# Altium schematic sheet 5Vto3V3Buck.SchDoc: 3V3 BUCK
size 431 x 279 mm; ApprovedBy: Wuji Zhang; CheckedBy: Wuji Zhang; Author: Wuji Zhang; CompanyName: Upenn; DrawnBy: Wuji Zhang; Engineer: Wuji Zhang; Organization: Upenn; Address1: ADDRESS 1; Address2: ADDRESS 2; Address3: ADDRESS 3; Address4: ADDRESS 4; Revision: -; SheetNumber: 2; SheetTotal: 9; ENG_APP_DATE: --/--/--; DSN_APP_DATE: --/--/--; CHK_APP_DATE: --/--/--
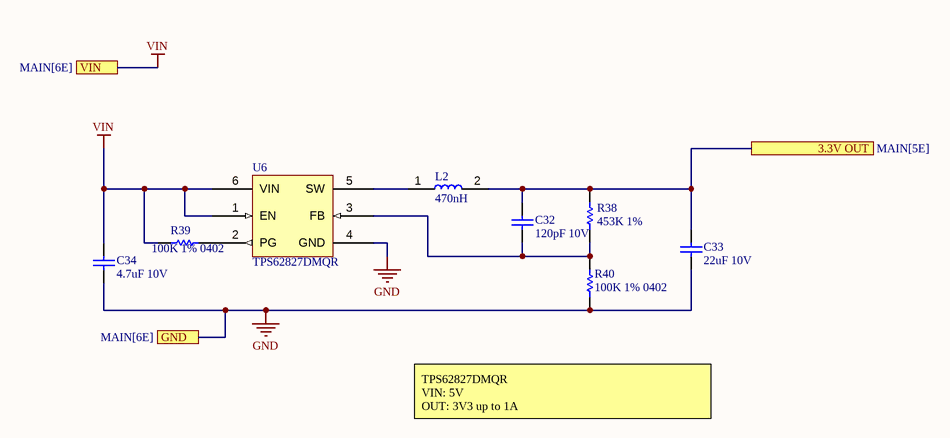
[diagram p0: 5Vto3V3Buck.SchDoc]

## Parts
C32  120pF 10V  [CAPC0603(1608)100_N]
C33  22uF 10V  [CAPC1608X100X20ML10]
C34  4.7uF 10V  [CAPC0603(1608)55_N]
L2  470nH  [MLP2012SR47MT0S1]
R38  453K 1%  [RESC0402(1005)_L]
R39  100K 1% 0402  [RESC0402(1005)_M]
R40  100K 1% 0402  [RESC0402(1005)_M]
U6  TPS62827DMQR  [Texas_Instruments_DMQ0006A_MFG]

## Ports
3.3V OUT (see MAIN[5E]), GND (see MAIN[6E]), VIN (see MAIN[6E])

## Nets
GND: C33.1 C34.1 R40.1 U6.4(GND) ; port GND
VIN: C34.2 R39.1 U6.1(EN) U6.6(VIN) ; port VIN
3.3V OUT: C32.2 C33.2 L2.2 R38.1 ; port 3.3V OUT
NetC32_1: C32.1 R38.2 R40.2 U6.3(FB)
NetL2_1: L2.1 U6.5(SW)
NetR39_2: R39.2 U6.2(PG)

## Notes on the sheet
- TPS62827DMQR
  VIN: 5V
  OUT: 3V3 up to 1A
- DWG. NO.
- REV.
- SHT.
- THIS DOCUMENT AND THE DATA DISCLOSED HEREIN OR HEREWITH IS THE PROPERTY OF ALTIUM LIMITED AND MAY BE FREELY DISTRIBUTED IN WHOLE. NO RIGHTS ARE RESERVED OR EXPRESS OR IMPLIED WARANTEE GIVEN.
- REVISION
- DESCRIPTION
- DATE
- APPROVED
- ENG:
- APPROVALS
- PROJECT
- DSN:
- CHK:
- REFERENCE DOCUMENTS
- PROJECT REVISION:
- TITLE
- DOCUMENT REVISION:
- DESIGN ITEM:
- BOM:
- FAB DWG:
- PCB DWG:
- ASSY DWG:
- SCALE:
- SIZE
- B
- CAGE CODE
- FILE NAME
- DWG NO.
- SHEET
- OF
- REV

## Library data of the parts
C32 = CMP-1035-01305-1: CAP 120pF 10V ±10% 0603 (1608 Metric) Thickness 1mm SMD; Case-EIA: 0603; Case-Metric: 1608; Tolerance: Â±10%; Technology: SMT; Rated Voltage: 10 V; Value: 120pF; Max Thickness: 1 mm
C33 = CMP-2000-05441-1: Chip Capacitor, 22 uF, +/- 20%, 10 V, -55 to 85 degC, 0603 (1608 Metric), RoHS, Tape and Reel; Manufacturer: TDK; PCN Part Number: MLCCPartNumberChange30/Nov/2012; Product Training Modules: CSeriesGeneralApplicationsSEAT,CCV,andTVCLDesignToolsGuidetoReplacinganElectrolyticCapacitorwithanMLCC; Other Names: 445-9077-1; Design Resources: 20WNon-IsolatedBuckLEDDriverUsingPLLNK460KG; Online Catalog: CSeries,GeneralPurpose; Capacitance: 22µF; Temperature Coefficient: X5R; Kits: 445-9014-KIT-ND-KITMLCC100PF-22UF060310-50V; Packaging: CutTape(CT); Standard Package: 1; Package / Case: 0603(1608Metric); Lead Style: -; Features: -; Ratings: -; Voltage - Rated: 10V; Operating Temperature: -55degC~85degC; Applications: GeneralPurpose; Package Reference: 603; Datasheet URL: http://download.siliconexpert.com/pdfs/2015/4/21/15/54/45/779/tdk_/manual/37024850441143360mlcc_commercial_general_en.pdf; Datasheet Version: Mar-15; Mounting Type: SurfaceMount,MLCC; Lead Spacing: -; Size / Dimension: 0.063"Lx0.031"W(1.60mmx0.80mm); Height - Seated (Max): -; Package Description: 2-Pin Surface Mount Device, Body 1.6 x 0.8 mm; Manufacturer URL: http://www.tdk.com/; RoHS Information: RoHSCertificate-MLCC; Tolerance: ±20%; Series: C; Thickness (Max): 0.035"(0.90mm); Family: CeramicCapacitors; Category: Capacitors
C34 = CMP-1035-02784-1: CAP 4.7uF 10V ±10% 0603 (1608 Metric) Thickness 0.55mm SMD; Case-Metric: 1608; Tolerance: Â±10%; Case-EIA: 0603; Technology: SMT; Max Thickness: 0.55 mm; Value: 4.7uF; Rated Voltage: 10 V
L2 = MLP2012SR47MT0S1: FIXED IND 470NH 1.2A 90 MOHM SMD; Manufacturer: TDK; Core Material: Ferrite; Tolerance: 20%; DC Resistance (DCR): 117mR; Shielding: Shielded; Test Frequency: 2MHz; Package: None; Price: None; Value: *; MP: MLP2012SR47MT0S1; Availability: Unavailable; Supplier 1: Digi-Key; Supplier Part Number 1: 445-6367-1-ND; Manufacturer Part Number: MLP2012SR47MT0S1; RoHS: Yes; Category: Fixed Inductors; Stock 1: 14052; Pricing 1: 1=0.33000, 10=0.29100, 25=0.25480, 50=0.21840, 100=0.20020, 250=0.18200, 500=0.17108, 1000=0.13104 (USD); Mount: Surface Mount; Case/Package: 0805; Case Code (Metric): 2012; Case Code (Imperial): 0805; Min Operating Temperature: -40°C; Max Operating Temperature: 125°C; Packaging: Tape and Reel; Inductance: 470nH; Package Quantity: 4000; Current Rating: 1.2A; Length: 0.079inch; Width: 0.049inch; Height - Seated (Max): 0.022inch; RoHS Compliant: Yes; ComponentLink1URL: https://product.tdk.com/info/en/catalog/datasheets/inductor_commercial_power_mlp2012_en.pdf?src-supplier=Digi-Key; ComponentLink1Description: https://product.tdk.com/info/en/catalog/datasheets/inductor_commercial_power_mlp2012_en.pdf?src-supplier=Digi-Key
R38 = CMP-1011-00810-1: 453K 0.063W 1% 0402 (1005 Metric)  SMD; Value: 453000.00 Ohm; Case-Metric: 1005; Case-EIA: 0402; Tolerance: 1 %; Power: 0.063 W; Technology: SMT
R39 R40 = CMP-1011-00736-1: 100K 0.063W 1% 0402 (1005 Metric)  SMD; Value: 100000.00 Ohm; Case-EIA: 0402; Case-Metric: 1005; Power: 0.063 W; Tolerance: 1 %; Technology: SMT
U6 = TPS62827DMQR: 2.4V-5.5V input, 4A step-down converter with 1% Accuracy in 1.5mm x 1.5mm QFN 6-VSON-HR -40 to 125; Manufacturer: Texas Instruments; Supplier 1: Digi-Key; Manufacturer Part Number: TPS62827DMQR; RoHS: Yes; Category: Voltage Regulators - Switching; Pricing 1: 1=1.93000, 10=1.73000, 25=1.63240, 100=1.30590, 250=1.14268, 500=1.11004, 1000=0.88150 (USD); RoHS Compliant: Yes; Supplier Part Number 1: 296-TPS62827DMQRCT-ND